# Altium schematic sheet contactor_connectors.SchDoc: foxBMS BMS-Master
size A3; DocumentNumber: 18; SheetNumber: 18; SheetTotal: 24; Author: Fraunhofer IISB foxBMS Team; REL-DATE: 2017-05-16; VERSION: 1.0.2; SheetDescription: Contactor Connectors
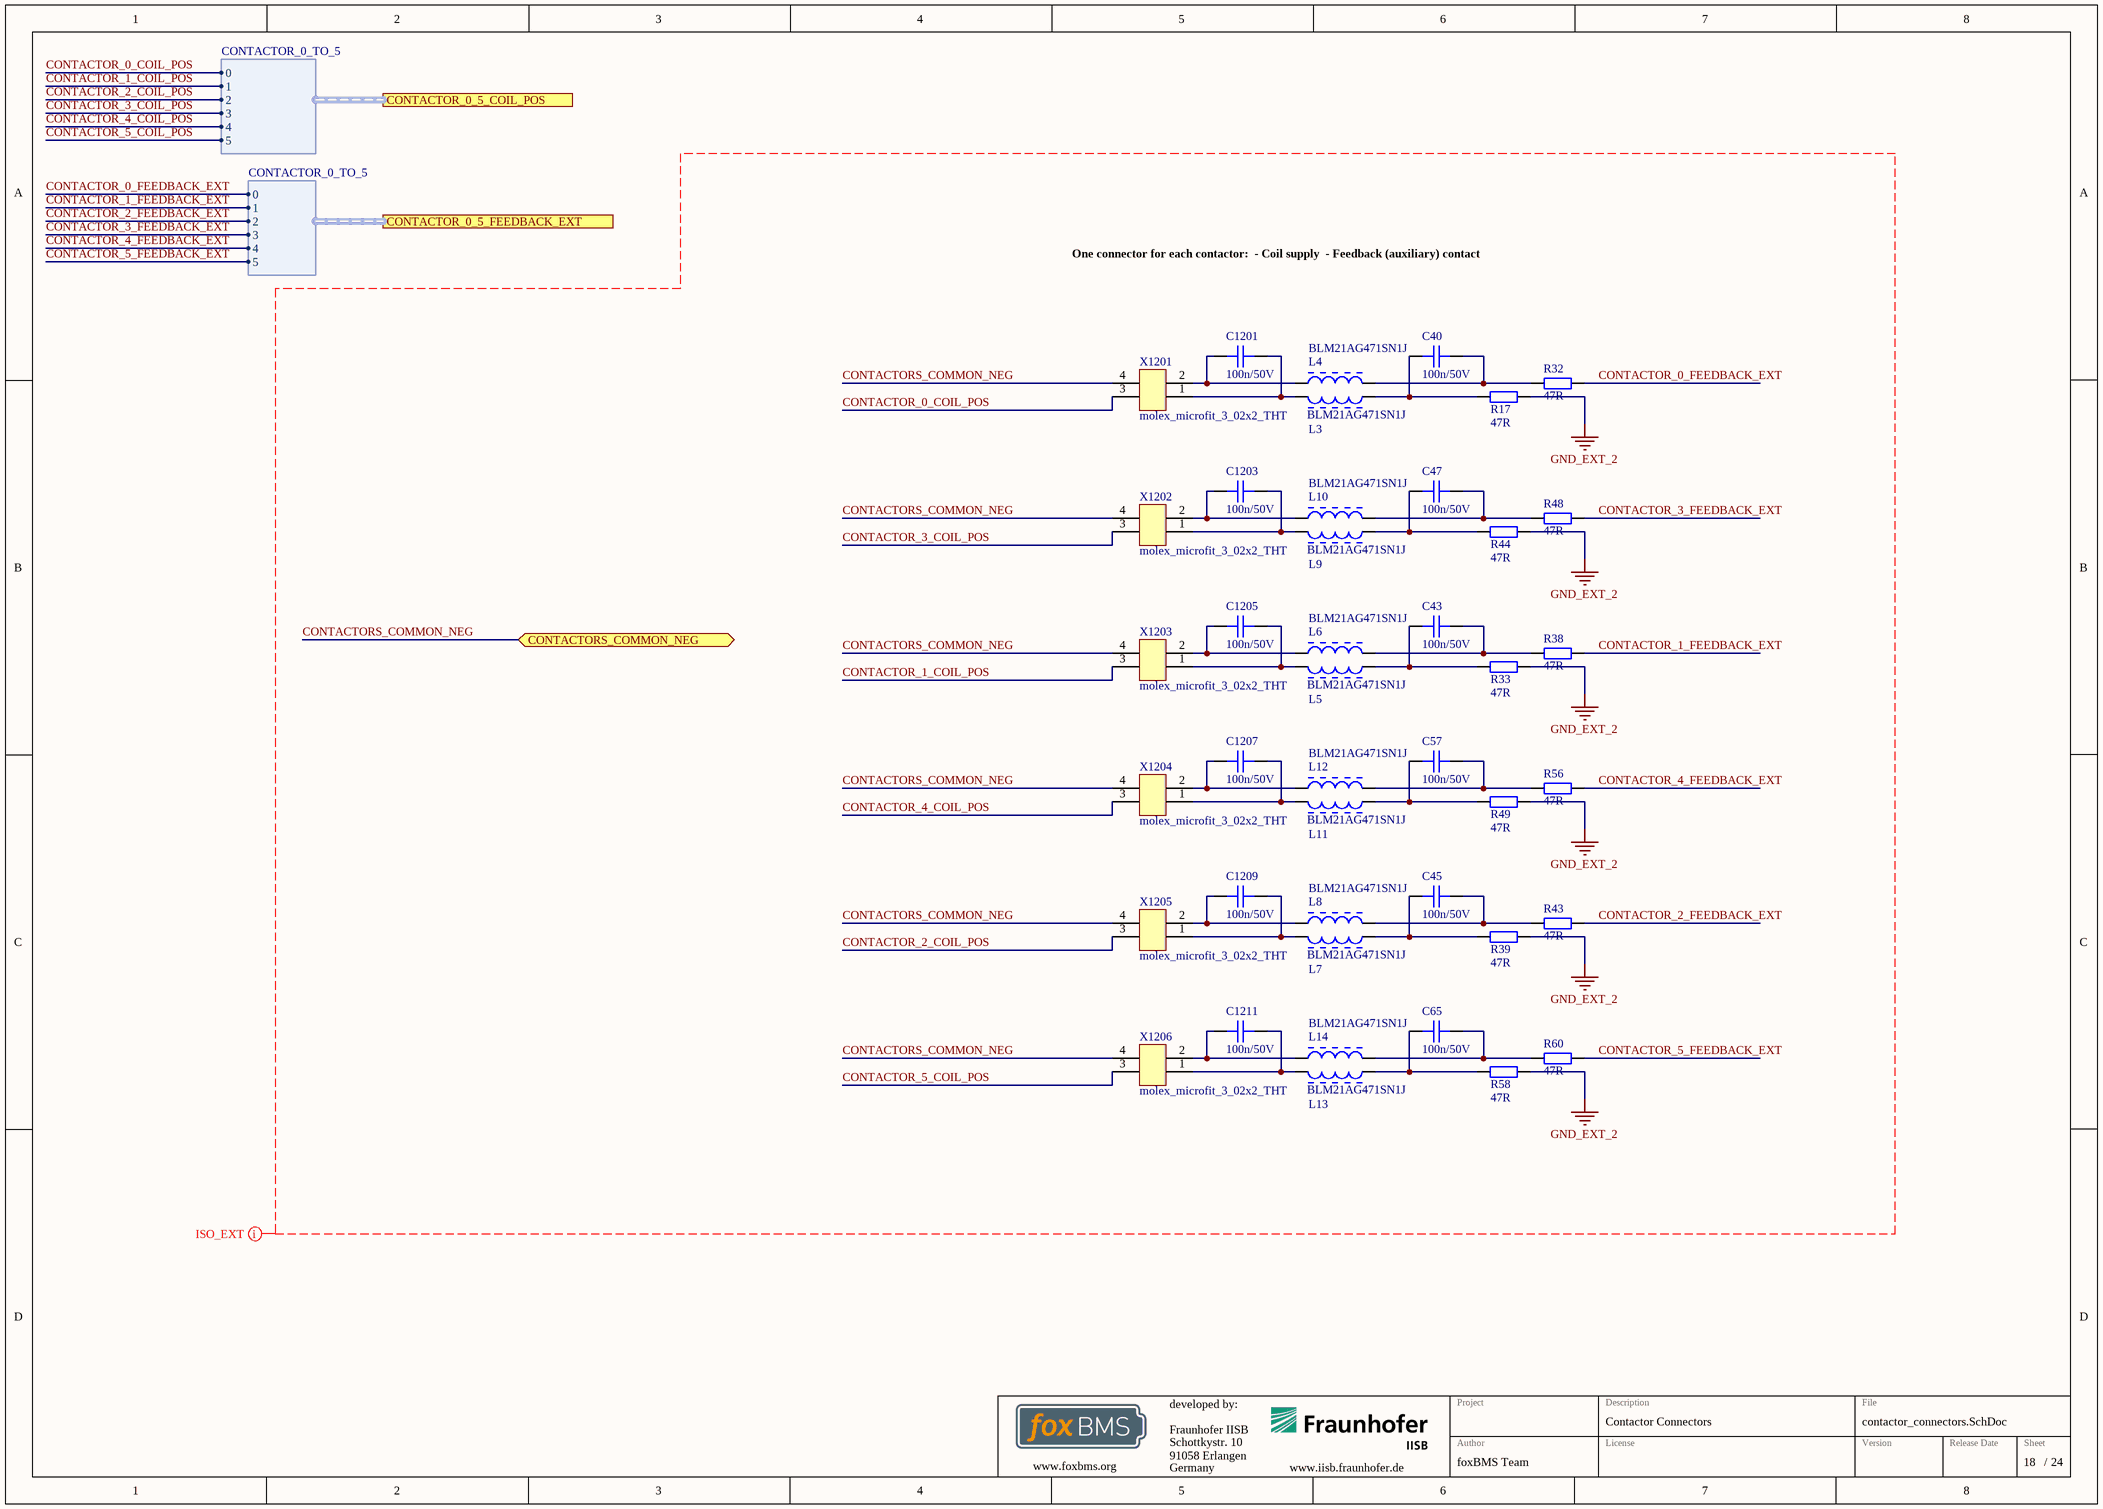
[diagram p0: contactor_connectors.SchDoc]

## Parts
C40  100n/50V  [0603C]
C43  100n/50V  [0603C]
C45  100n/50V  [0603C]
C47  100n/50V  [0603C]
C57  100n/50V  [0603C]
C65  100n/50V  [0603C]
C1201  100n/50V  [0603C]
C1203  100n/50V  [0603C]
C1205  100n/50V  [0603C]
C1207  100n/50V  [0603C]
C1209  100n/50V  [0603C]
C1211  100n/50V  [0603C]
L3  BLM21AG471SN1J  [MURA-BLM21-H1-CHIP-2_V]
L4  BLM21AG471SN1J  [MURA-BLM21-H1-CHIP-2_V]
L5  BLM21AG471SN1J  [MURA-BLM21-H1-CHIP-2_V]
L6  BLM21AG471SN1J  [MURA-BLM21-H1-CHIP-2_V]
L7  BLM21AG471SN1J  [MURA-BLM21-H1-CHIP-2_V]
L8  BLM21AG471SN1J  [MURA-BLM21-H1-CHIP-2_V]
L9  BLM21AG471SN1J  [MURA-BLM21-H1-CHIP-2_V]
L10  BLM21AG471SN1J  [MURA-BLM21-H1-CHIP-2_V]
L11  BLM21AG471SN1J  [MURA-BLM21-H1-CHIP-2_V]
L12  BLM21AG471SN1J  [MURA-BLM21-H1-CHIP-2_V]
L13  BLM21AG471SN1J  [MURA-BLM21-H1-CHIP-2_V]
L14  BLM21AG471SN1J  [MURA-BLM21-H1-CHIP-2_V]
R17  47R  [0603R]
R32  47R  [0603R]
R33  47R  [0603R]
R38  47R  [0603R]
R39  47R  [0603R]
R43  47R  [0603R]
R44  47R  [0603R]
R48  47R  [0603R]
R49  47R  [0603R]
R56  47R  [0603R]
R58  47R  [0603R]
R60  47R  [0603R]
X1201  molex_microfit_3_02x2_THT  [43045-0421]
X1202  molex_microfit_3_02x2_THT  [43045-0421]
X1203  molex_microfit_3_02x2_THT  [43045-0421]
X1204  molex_microfit_3_02x2_THT  [43045-0421]
X1205  molex_microfit_3_02x2_THT  [43045-0421]
X1206  molex_microfit_3_02x2_THT  [43045-0421]

## Ports
CONTACTOR_0_5_COIL_POS (harness CONTACTOR_0_TO_5), CONTACTOR_0_5_FEEDBACK_EXT (harness CONTACTOR_0_TO_5), CONTACTORS_COMMON_NEG (bidir)

## Harnesses
CONTACTOR_0_TO_5: 0, 1, 2, 3, 4, 5

## Nets
GND_EXT_2: R17.2 R33.2 R39.2 R44.2 R49.2 R58.2
CONTACTOR_0_COIL_POS: X1201.3 ; port CONTACTOR_0_5_COIL_POS.0
CONTACTOR_0_FEEDBACK_EXT: R32.1 ; port CONTACTOR_0_5_FEEDBACK_EXT.0
CONTACTOR_1_COIL_POS: X1203.3 ; port CONTACTOR_0_5_COIL_POS.1
CONTACTOR_1_FEEDBACK_EXT: R38.1 ; port CONTACTOR_0_5_FEEDBACK_EXT.1
CONTACTOR_2_COIL_POS: X1205.3 ; port CONTACTOR_0_5_COIL_POS.2
CONTACTOR_2_FEEDBACK_EXT: R43.2 ; port CONTACTOR_0_5_FEEDBACK_EXT.2
CONTACTOR_3_COIL_POS: X1202.3 ; port CONTACTOR_0_5_COIL_POS.3
CONTACTOR_3_FEEDBACK_EXT: R48.1 ; port CONTACTOR_0_5_FEEDBACK_EXT.3
CONTACTOR_4_COIL_POS: X1204.3 ; port CONTACTOR_0_5_COIL_POS.4
CONTACTOR_4_FEEDBACK_EXT: R56.2 ; port CONTACTOR_0_5_FEEDBACK_EXT.4
CONTACTOR_5_COIL_POS: X1206.3 ; port CONTACTOR_0_5_COIL_POS.5
CONTACTOR_5_FEEDBACK_EXT: R60.2 ; port CONTACTOR_0_5_FEEDBACK_EXT.5
CONTACTORS_COMMON_NEG: X1201.4 X1202.4 X1203.4 X1204.4 X1205.4 X1206.4 ; port CONTACTORS_COMMON_NEG
NetC40_1: C40.1 L3.2 R17.1
NetC40_2: C40.2 L4.2 R32.2
NetC43_1: C43.1 L5.2 R33.1
NetC43_2: C43.2 L6.2 R38.2
NetC45_1: C45.1 L7.2 R39.1
NetC45_2: C45.2 L8.2 R43.1
NetC47_1: C47.1 L9.2 R44.1
NetC47_2: C47.2 L10.2 R48.2
NetC57_1: C57.1 L11.2 R49.1
NetC57_2: C57.2 L12.2 R56.1
NetC65_1: C65.1 L13.2 R58.1
NetC65_2: C65.2 L14.2 R60.1
NetC1201_1: C1201.1 L4.1 X1201.2
NetC1201_2: C1201.2 L3.1 X1201.1
NetC1203_1: C1203.1 L10.1 X1202.2
NetC1203_2: C1203.2 L9.1 X1202.1
NetC1205_1: C1205.1 L6.1 X1203.2
NetC1205_2: C1205.2 L5.1 X1203.1
NetC1207_1: C1207.1 L12.1 X1204.2
NetC1207_2: C1207.2 L11.1 X1204.1
NetC1209_1: C1209.1 L8.1 X1205.2
NetC1209_2: C1209.2 L7.1 X1205.1
NetC1211_1: C1211.1 L14.1 X1206.2
NetC1211_2: C1211.2 L13.1 X1206.1

## Layout directives
net class ISO_EXT: CONTACTOR_0_COIL_POS, CONTACTOR_0_FEEDBACK_EXT, CONTACTOR_1_COIL_POS, CONTACTOR_1_FEEDBACK_EXT, CONTACTOR_2_COIL_POS, CONTACTOR_2_FEEDBACK_EXT, CONTACTOR_3_COIL_POS, CONTACTOR_3_FEEDBACK_EXT, CONTACTOR_4_COIL_POS, CONTACTOR_4_FEEDBACK_EXT, CONTACTOR_5_COIL_POS, CONTACTOR_5_FEEDBACK_EXT, CONTACTORS_COMMON_NEG, GND_EXT_2

## Notes on the sheet
- One connector for each contactor:
  - Coil supply
  - Feedback (auxiliary) contact
- Fraunhofer IISB
- Schottkystr. 10
- developed by:
- 91058 Erlangen
- Germany
- Author
- Project
- License
- Description
- File
- Version
- Release Date
- Sheet
- www.foxbms.org
- www.iisb.fraunhofer.de
- foxBMS Team
- /

## Library data of the parts
C40 C43 C45 C47 C57 C65 C1201 C1203 C1205 C1207 C1209 C1211 = gen_C_ceramic_100n_50V_X7R_0603: MLCC; Capacitance: 100n; Rated Voltage: 50V; Dielectric: X7R; Case EIA: 0603; Case Metric: 1608; PnP Package: C_0603_10; PnP Value: 100n/50V/X7R; PnP equipped: x; Automotive Qualified: False; Part Number: gen_C_ceramic_100n_50V_X7R_0603; Supplier 1: Farnell; Supplier Part Number 1: 2525267; Supplier 2: Digikey; Supplier Part Number 2: 490-6049-1-ND
L3-L14 = C5133952-28DE-41F1-874F-4A9C3E40D898: Chip Ferrite Bead for General Signal lines, 470 Ohm, 700 mA, -55 to 125 degC, 2 x 1.25 x 1.05 mm SMD, Tape and Reel; Manufacturer: Murata; DC Resistance: 0.19 Ohm Max.; Impedance (at 100 MHz): 470 Ohm +/- 25%; Rated Current: 700 mA; ComponentLink1URL: http://www.murata.com/; Packing: Tape and Reel; PackageDescription: 2-Pin Chip, Body 2 x 1.25 mm; ComponentLink3Description: Package Specification; Operating Temperature Range: -55 to 125 degC; ComponentLink1Description: Manufacturer URL; PartNumber: BLM21AG471SN1J; DatasheetVersion: 08/2013; Mounting Technology: Surface Mount; ComponentLink2URL: http://www.murata.com/products/catalog/pdf/c31e.pdf; ComponentLink3URL: http://www.murata.com/products/catalog/pdf/c31e.pdf; ComponentLink2Description: Datasheet; PackageReference: BLM21_H1050-2
R17 R32 R33 R38 R39 R43 R44 R48 R49 R56 R58 R60 = gen_R_47R_0603: SMD Resistor 47R 0603; Tolerance: 1%; Power: 0.1W; Case EIA: 0603; Case Metric: 1608; Maximum Working Voltage: 75V; PnP Package: R_0603; Automotive Qualified: False; Part Number: gen_R_47R_0603; Operating Temperature: -55°C - +155°C; Resistance: 47R; Series: E24; PnP Value: 47R; Supplier 1: Farnell; Supplier Part Number 1: 2303030
X1201-X1206 = molex_microfit_3_02x2_THT: Micro-Fit 3.0 Right Angle Header, 3.00mm Pitch, Dual Row, 4 Circuits, with Snap-in Plastic Peg PCB Lock, Tin, Glow Wire Capable, Black, 43045-0400; Manufacturer: Molex; Circuits: 4; Rated Voltage: 600V; Rated Current: 8.5A; Automotive Qualified: False; Part Number: molex_microfit_3_02x2_THT; Part Name: MicroFit; Operating Temperature: -40°C - +105°C; Supplier 1: Farnell; Supplier Part Number 1: 9733019